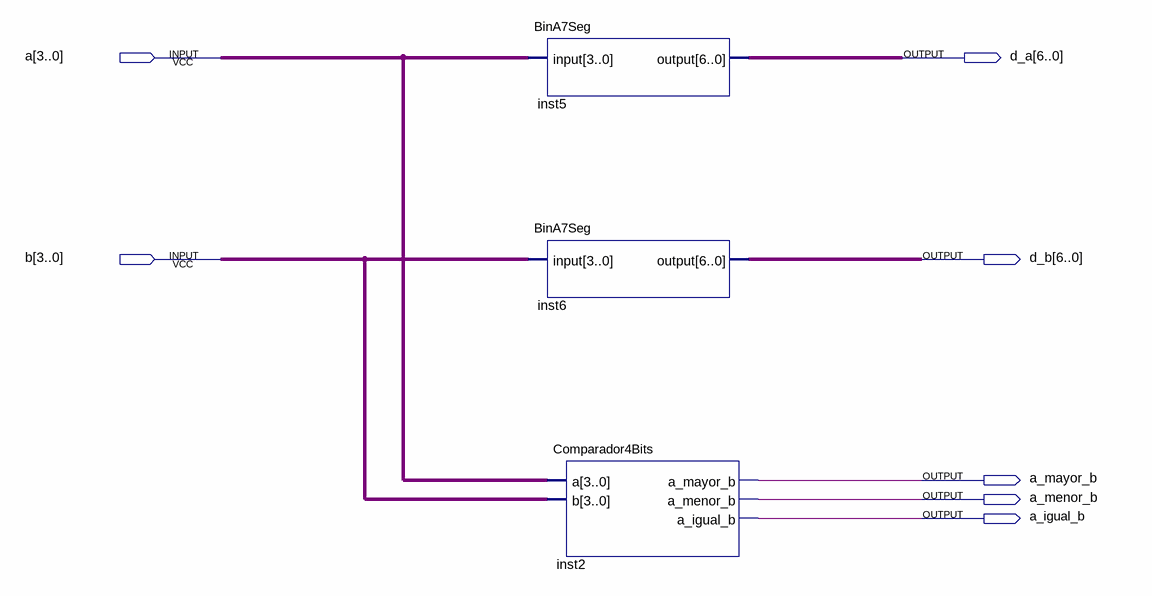
[diagram p0: schematic sheet]
// Quartus schematic Practica4.bdf as structural Verilog: 3 symbols, 7 pins
module Practica4 (
  input  [3:0] a,
  input  [3:0] b,
  output [6:0] d_a,
  output [6:0] d_b,
  output a_mayor_b,
  output a_menor_b,
  output a_igual_b
);

  BinA7Seg inst5 (.\input (a), .\output (d_a));
  BinA7Seg inst6 (.\input (b), .\output (d_b));
  Comparador4Bits inst2 (.a(a), .b(b), .a_mayor_b(a_mayor_b), .a_menor_b(a_menor_b), .a_igual_b(a_igual_b));
endmodule
